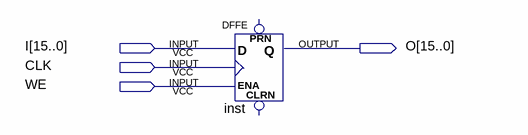
[diagram p0: schematic sheet]
// Quartus schematic Reg16.bdf as structural Verilog: 1 symbols, 4 pins
module Reg16 (
  input  [15:0] I,
  input  CLK,
  input  WE,
  output [15:0] O
);

  DFFE inst[15:0] (.D(I), .CLK(CLK), .ENA(WE), .Q(O));  // open: PRN, CLRN
endmodule
